# Altium project KORUZA_PowerModule_v2.PrjPcb
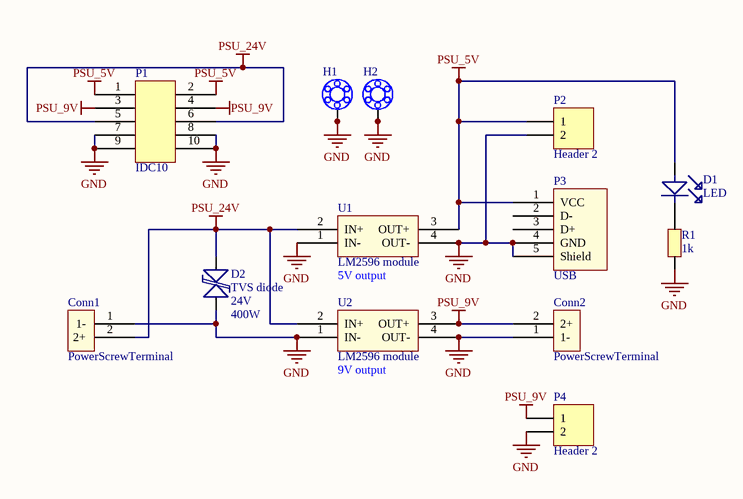
[diagram p0: KORUZA_PowerModule_v2.SchDoc]
1 sheet, 13 parts. Net scope: global (net labels, ports and power ports of the same name join across sheets).
Board file: KORUZA_PowerModule_v2.PcbDoc

## Sheet KORUZA_PowerModule_v2.SchDoc
size A4

### Parts
Conn1  PowerScrewTerminal  [MKDSN 2,5/ 2-5,08]
Conn2  PowerScrewTerminal  [MKDSN 2,5/ 2-5,08]
D1  LED  [1206/0805 diode]
D2  TVS diode  Voltage: 24V  Power: 400W  [DIOM4750X18N]
H1  M  [MOUNTING]  (value not drawn)  (no BOM)
H2  M  [MOUNTING]  (value not drawn)  (no BOM)
P1  IDC10  [IDC10]
P2  Header 2  [HDR1X2]
P3  USB  [USB A THT]
P4  Header 2  [HDR1X2]
R1  1k  [RESC2012X06N]
U1  LM2596 module  [LM2596 module]
U2  LM2596 module  [LM2596 module]

### Nets
GND: Conn1.1(1-) Conn2.1(1-) D2.1 H1.1 H1.2 H1.3 H1.4 H1.5 H1.6 H1.7 H2.1 H2.2 H2.3 H2.4 H2.5 H2.6 H2.7 P1.7 P1.8 P1.9 P1.10 P2.2 P3.4(GND) P3.5(Shield) P4.2 R1.1 U1.1(IN-) U1.4(OUT-) U2.1(IN-) U2.4(OUT-)
PSU_5V: D1.1 P1.1(A) P1.2 P2.1 P3.1(VCC) U1.3(OUT+)
PSU_9V: Conn2.2(2+) P1.3 P1.4 P4.1 U2.3(OUT+)
PSU_24V: Conn1.2(2+) D2.2 P1.5 P1.6 U1.2(IN+) U2.2(IN+)
NetD1_2: D1.2 R1.2

Not connected (* = marked no-connect by the designer): P3 2(D-) 3(D+)

### Notes on the sheet
- 5V output
- (near U2) 9V output

### Library data of the parts
D1 = LED: LED diode
D2 = TVS diode: TVS bidirectional diode
H1 H2 = MOUNTING: MOUNTING HOLE - NON INSTALLABLE
P1 = IDC10: IDC 10pin
P2 P4 = Header 2: Header, 2-Pin; LatestRevisionDate: 17-Jul-2002; LatestRevisionNote: Re-released for DXP Platform.; Publisher: Altium Limited
P3 = USB: USB A standard receptacle
R1 = Resistor: Resistor 0805 smd